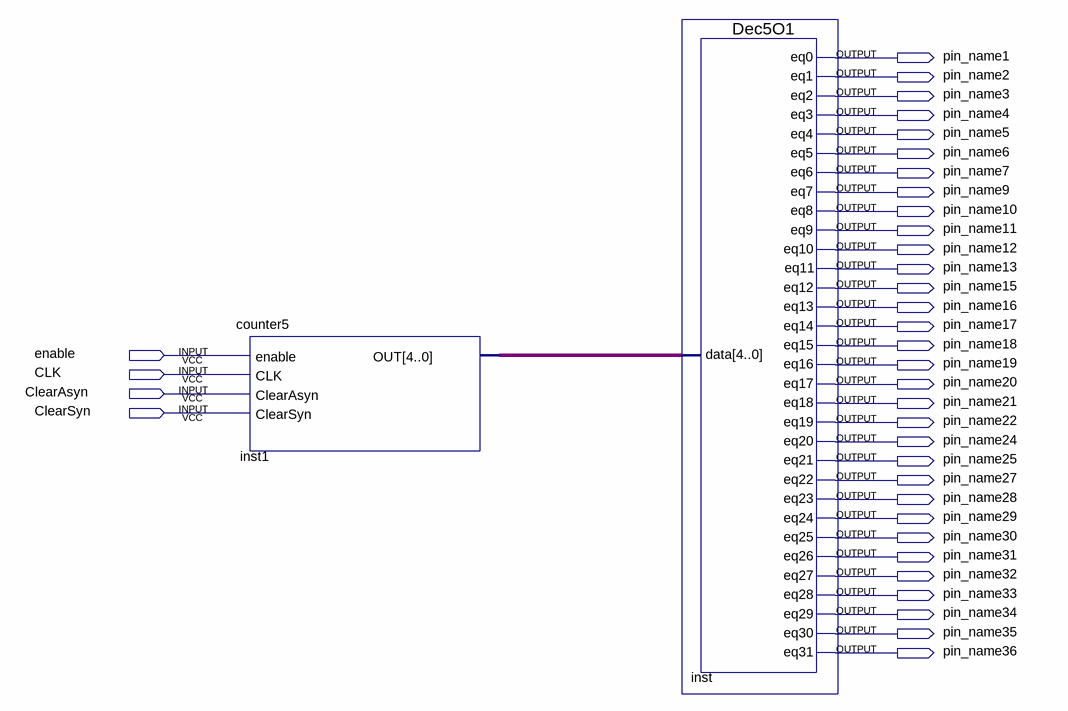
[diagram p0: schematic sheet]
// Quartus schematic counterTest.bdf as structural Verilog: 2 symbols, 36 pins
module counterTest (
  input  enable,
  input  CLK,
  input  ClearAsyn,
  input  ClearSyn,
  output pin_name1,
  output pin_name2,
  output pin_name3,
  output pin_name4,
  output pin_name5,
  output pin_name6,
  output pin_name7,
  output pin_name9,
  output pin_name10,
  output pin_name11,
  output pin_name12,
  output pin_name13,
  output pin_name15,
  output pin_name16,
  output pin_name17,
  output pin_name18,
  output pin_name19,
  output pin_name20,
  output pin_name21,
  output pin_name22,
  output pin_name24,
  output pin_name25,
  output pin_name27,
  output pin_name28,
  output pin_name29,
  output pin_name30,
  output pin_name31,
  output pin_name32,
  output pin_name33,
  output pin_name34,
  output pin_name35,
  output pin_name36
);

  wire [4:0] inst1_out;

  counter5 inst1 (.enable(enable), .CLK(CLK), .ClearAsyn(ClearAsyn), .ClearSyn(ClearSyn), .OUT(inst1_out));
  Dec5O1 inst (
    .data(inst1_out), .eq0(pin_name1), .eq1(pin_name2), .eq2(pin_name3), .eq3(pin_name4), .eq4(pin_name5),
    .eq5(pin_name6), .eq6(pin_name7), .eq7(pin_name9), .eq8(pin_name10), .eq9(pin_name11), .eq10(pin_name12),
    .eq11(pin_name13), .eq12(pin_name15), .eq13(pin_name16), .eq14(pin_name17), .eq15(pin_name18),
    .eq16(pin_name19), .eq17(pin_name20), .eq18(pin_name21), .eq19(pin_name22), .eq20(pin_name24),
    .eq21(pin_name25), .eq22(pin_name27), .eq23(pin_name28), .eq24(pin_name29), .eq25(pin_name30),
    .eq26(pin_name31), .eq27(pin_name32), .eq28(pin_name33), .eq29(pin_name34), .eq30(pin_name35),
    .eq31(pin_name36));
endmodule
